# Altium schematic sheet Oscar_MainBoard_Root.SchDoc
size A4
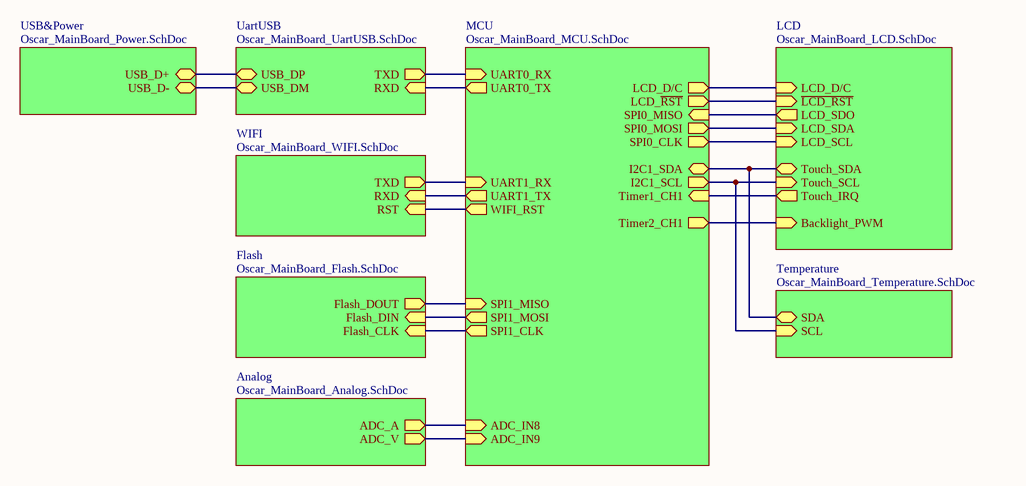
[diagram p0: Oscar_MainBoard_Root.SchDoc]

## Sub-sheets
Analog = Oscar_MainBoard_Analog.SchDoc: ADC_A (out), ADC_V (out)
Flash = Oscar_MainBoard_Flash.SchDoc: Flash_CLK (in), Flash_DIN (in), Flash_DOUT (out)
LCD = Oscar_MainBoard_LCD.SchDoc: Touch_SCL (in), LCD_SDA (in), LCD_SDO (out), LCD_D/C (in), Backlight_PWM (in), LCD_SCL (in), Touch_SDA (bidir), Touch_IRQ (out), ~{LCD_RST} (in)
MCU = Oscar_MainBoard_MCU.SchDoc: UART1_RX (in), UART1_TX (out), SPI0_MISO (in), SPI0_CLK (out), UART0_RX (in), SPI1_CLK (out), SPI1_MOSI (out), SPI0_MOSI (out), UART0_TX (out), SPI1_MISO (in), I2C1_SDA (bidir), I2C1_SCL (out), LCD_D/C (out), LCD_~{RST} (out), Timer2_CH1 (out), Timer1_CH1 (in), WIFI_RST (out), ADC_IN8 (in), ADC_IN9 (in)
Temperature = Oscar_MainBoard_Temperature.SchDoc: SCL (in), SDA (bidir)
UartUSB = Oscar_MainBoard_UartUSB.SchDoc: USB_DM, USB_DP, RXD (in), TXD (out)
USB&Power = Oscar_MainBoard_Power.SchDoc: USB_D+, USB_D-
WIFI = Oscar_MainBoard_WIFI.SchDoc: TXD (out), RXD (in), RST (in)

## Nets
(unnamed): sheet MCU/UART1_RX, sheet WIFI/TXD
(unnamed): sheet MCU/UART1_TX, sheet WIFI/RXD
(unnamed): sheet MCU/SPI0_MISO, sheet LCD/LCD_SDO
(unnamed): sheet MCU/SPI0_CLK, sheet LCD/LCD_SCL
(unnamed): sheet MCU/UART0_RX, sheet UartUSB/TXD
(unnamed): sheet MCU/SPI1_CLK, sheet Flash/Flash_CLK
(unnamed): sheet MCU/SPI1_MOSI, sheet Flash/Flash_DIN
(unnamed): sheet MCU/SPI0_MOSI, sheet LCD/LCD_SDA
(unnamed): sheet MCU/UART0_TX, sheet UartUSB/RXD
(unnamed): sheet MCU/SPI1_MISO, sheet Flash/Flash_DOUT
(unnamed): sheet MCU/I2C1_SDA, sheet LCD/Touch_SDA, sheet Temperature/SDA
(unnamed): sheet MCU/I2C1_SCL, sheet LCD/Touch_SCL, sheet Temperature/SCL
(unnamed): sheet MCU/LCD_D/C, sheet LCD/LCD_D/C
(unnamed): sheet MCU/LCD_~{RST}, sheet LCD/~{LCD_RST}
(unnamed): sheet MCU/Timer2_CH1, sheet LCD/Backlight_PWM
(unnamed): sheet MCU/Timer1_CH1, sheet LCD/Touch_IRQ
(unnamed): sheet MCU/WIFI_RST, sheet WIFI/RST
(unnamed): sheet MCU/ADC_IN8, sheet Analog/ADC_A
(unnamed): sheet MCU/ADC_IN9, sheet Analog/ADC_V
(unnamed): sheet USB&Power/USB_D+, sheet UartUSB/USB_DP
(unnamed): sheet USB&Power/USB_D-, sheet UartUSB/USB_DM